# EasyEDA Pro project ProPrj_New Project_2026-05-24_21-45-30_2026-05-25.epro

# Schematic Schematic1
Board Name: Board1; Create Date: 2026-05-24; Page Name: P1; Project Name: New Project_2026-05-24_21-45-30; Schematic Name: Schematic1; Update Date: 2026-05-24; Company: EasyEDA.com; Page Size: A4; Version: V1.0
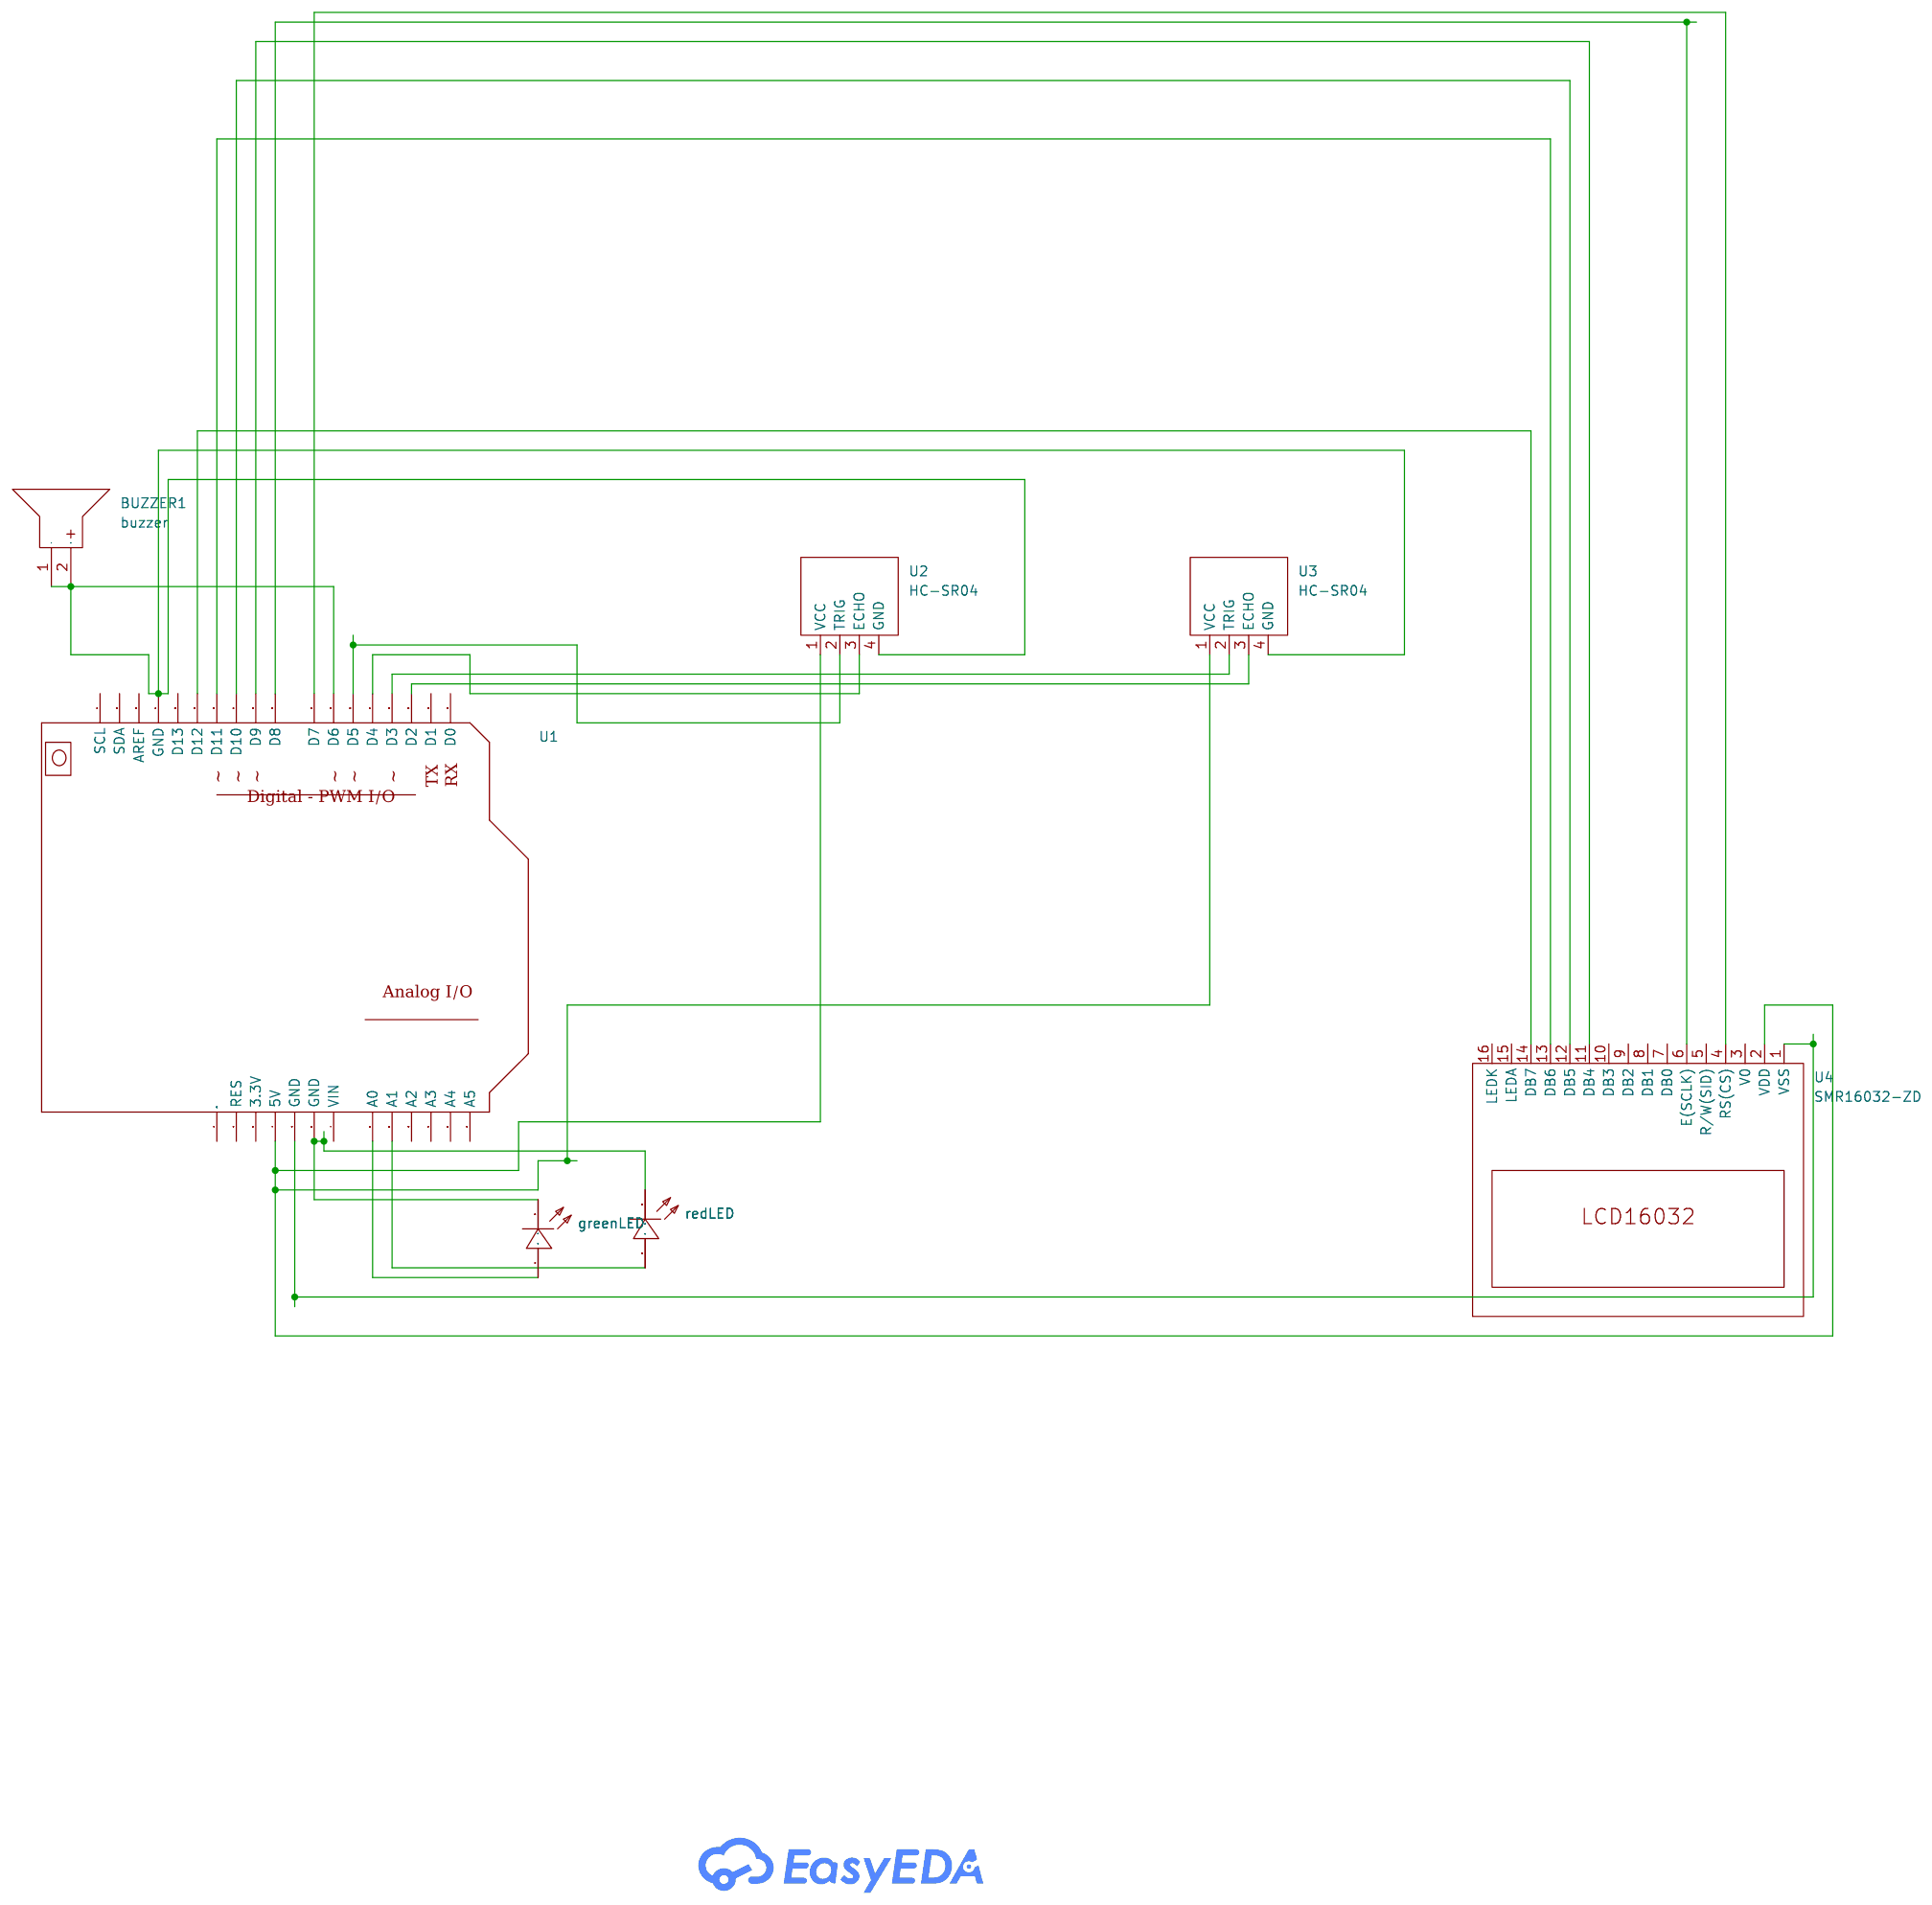
[diagram p0: schematic sheet]

## Parts
BUZZER1  buzzer  [BUZ-TH_BD12.0-P6.00-D0.9-RD]
greenLED  KT-0805G  [LED0805-R-RD]
redLED  KT-0805G  [LED0805-R-RD]
U1  -  [ARDUINO UNO R3 FOOTPRINT]
U2  HC-SR04  [TH_HC-SR04V]
U3  HC-SR04  [TH_HC-SR04V]
U4  SMR16032-ZD  [LCD-TH_SMR16032-ZD]

## Library data of the parts
BUZZER1 = buzzer: Supplier Part: C9900014030; JLCPCB Part Class: Extended Part; Supplier: LCSC
greenLED redLED = KT-0805G: Lamp Holder Type:2mm x 1.25mm square LED Illumination Color:Emerald Green Voltage - Forward(Vf):2.6V~3.1V Voltage - Forward(Vf):2.6V~3.1V Power(Watts):100mW Forward Current:5mA Wavelength - Dominant:513nm~528nm Wavelength - Dominant:513nm~528nm Peak Wavel; LCSC Part Name: 0805 翠绿 高亮; Supplier Part: C2297; Manufacturer: KENTO; Supplier Footprint: 0805; JLCPCB Part Class: Basic Part; Datasheet: https://item.szlcsc.com/datasheet/KT-0805G/2670.html; Supplier: LCSC; Lamp Holder Type: 2mm x 1.25mm square LED; Illumination Color: Emerald Green; Voltage - Forward(Vf): 2.6V~3.1V; Power(Watts): 100mW; Forward Current: 5mA; Wavelength - Dominant: 513nm~528nm; Peak Wavelength: 525nm; Diode Configuration: Discrete Diode; Lens Color: Water Clear; Luminous Intensity: 430mcd; Viewing Angle: 120°; Operating Temperature: -40℃~+85℃
U1 = Arduino Uno
U2 U3 = HC-SR04: Supplier Part: C19857336; Manufacturer: Universal Microelectronics; JLCPCB Part Class: Extended Part; Datasheet: https://item.szlcsc.com/datasheet/HC-SR04/21184790.html; Supplier: LCSC
U4 = SMR16032-ZD: Supplier Part: C9900249207; Supplier Footprint: LCD16032; Supplier: LCSC

## Nets
$1N2005: U1.26(D5) U2.2(TRIG)
$1N2008: U1.27(D4) U2.3(ECHO)
$1N2114: U1.29(D2) U3.3(ECHO)
$1N2119: U1.28(D3) U3.2(TRIG)
$1N2145: BUZZER1.1(-) BUZZER1.2(+) U1.17(GND) U1.25(D6) U2.4(GND) U3.4(GND)
$1N2179: U1.4(5V) U2.1(VCC) U3.1(VCC) U4.2(VDD)
$1N2219: U1.5(GND) U4.1(VSS)
$1N2269: U1.24(D7) U4.4(RS(CS))
$1N2279: U1.23(D8) U4.6(E(SCLK))
$1N2289: U1.22(D9) U4.11(DB4)
$1N2299: U1.21(D10) U4.12(DB5)
$1N2311: U1.20(D11) U4.13(DB6)
$1N2323: U1.19(D12) U4.14(DB7)
$1N2336: greenLED.1(A) U1.8(A0)
$1N2372: greenLED.2(K) redLED.2(K) U1.6(GND)
$1N2377: redLED.1(A) U1.9(A1)

Not connected (* = marked no-connect by the designer): U1 1(blnk) 2(RES) 3(3.3V) 7(VIN) 10(A2) 11(A3) 12(A4) 13(A5) 14(SCL) 15(SDA) 16(AREF) 18(D13) 30(D1) 31(D0); U4 3(V0) 5(R/W(SID)) 7(DB0) 8(DB1) 9(DB2) 10(DB3) 15(LEDA) 16(LEDK)

# Board PCB1
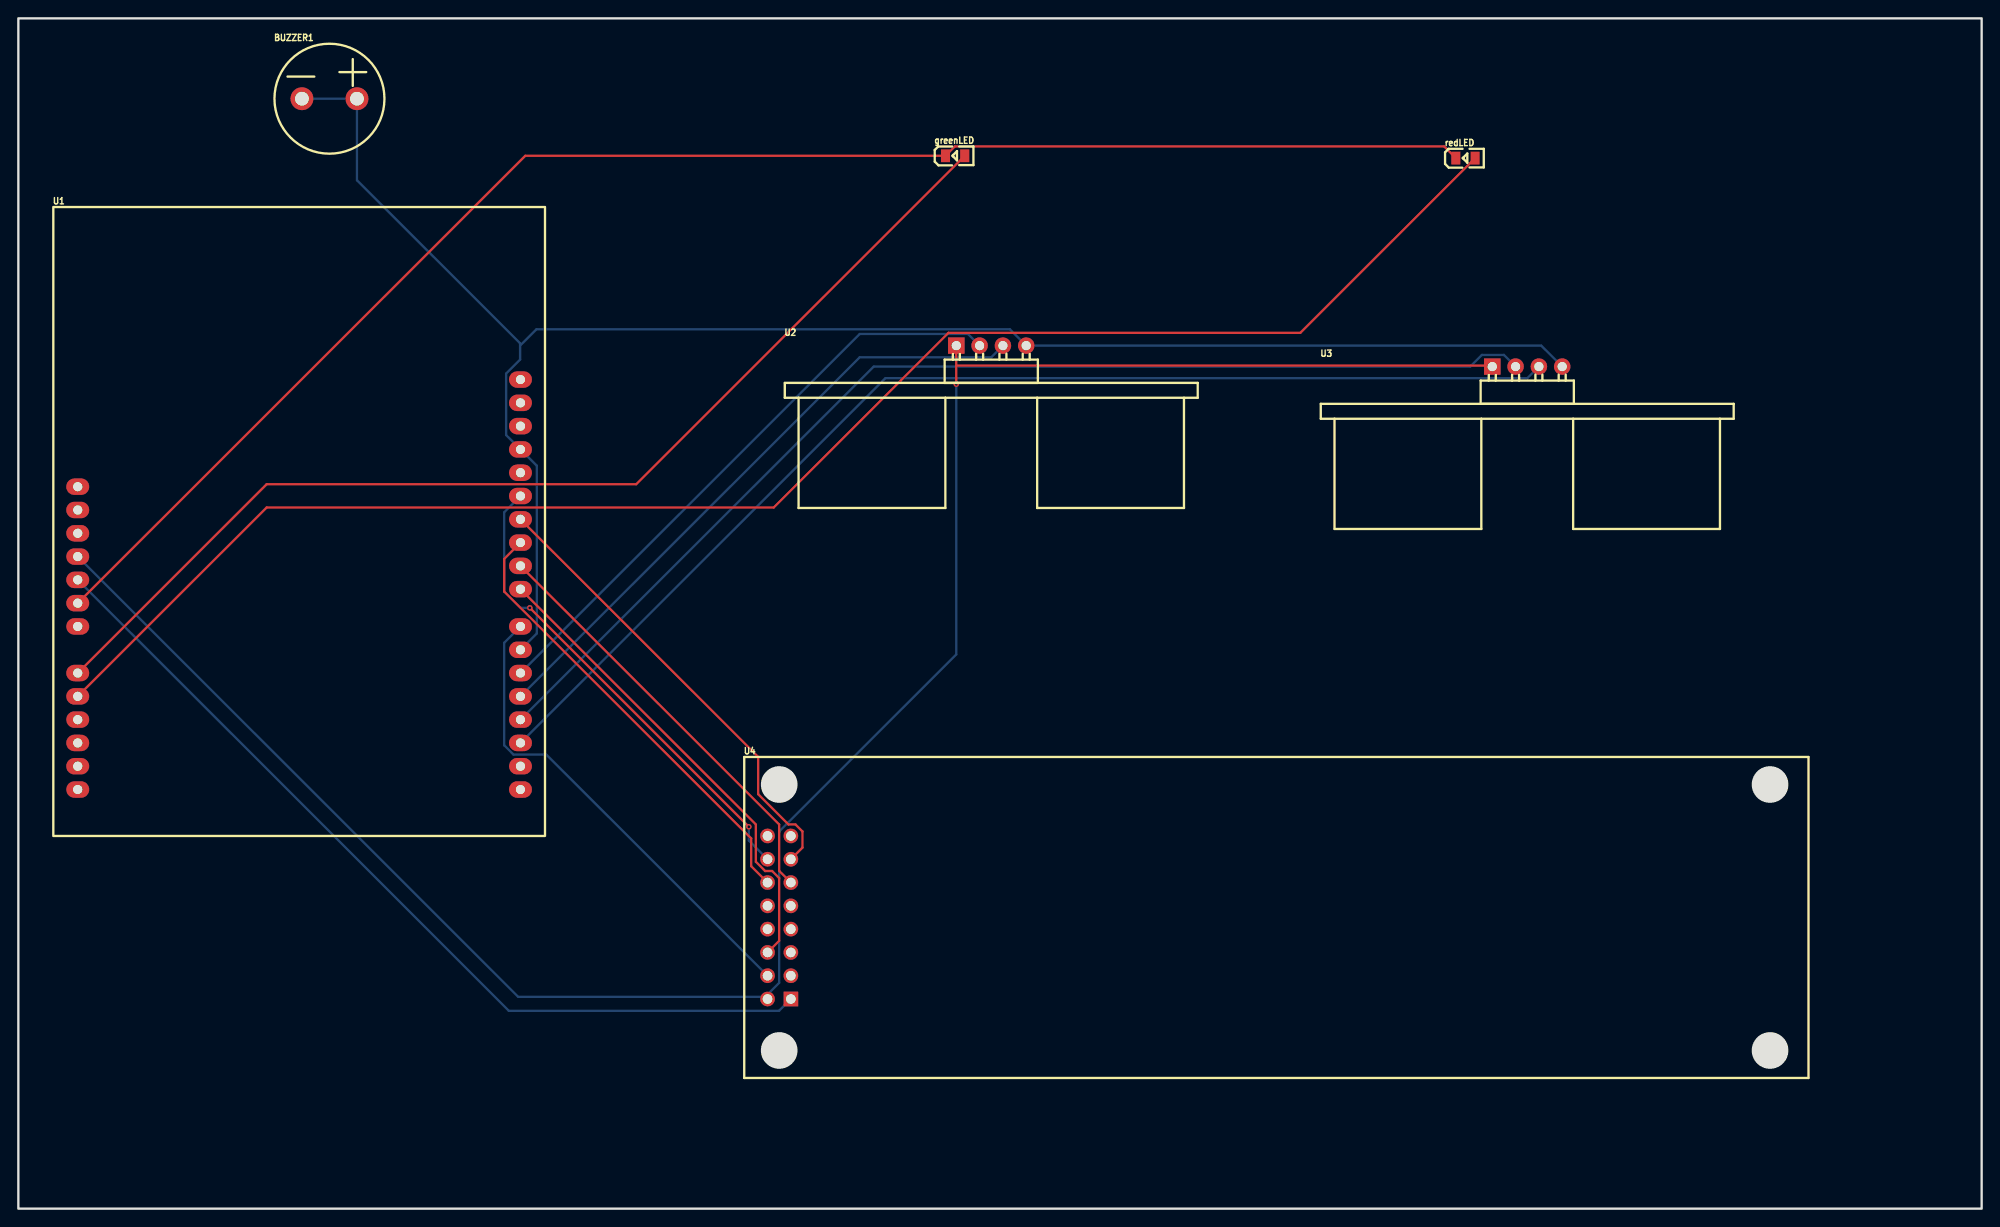
[diagram p1: board, top side]
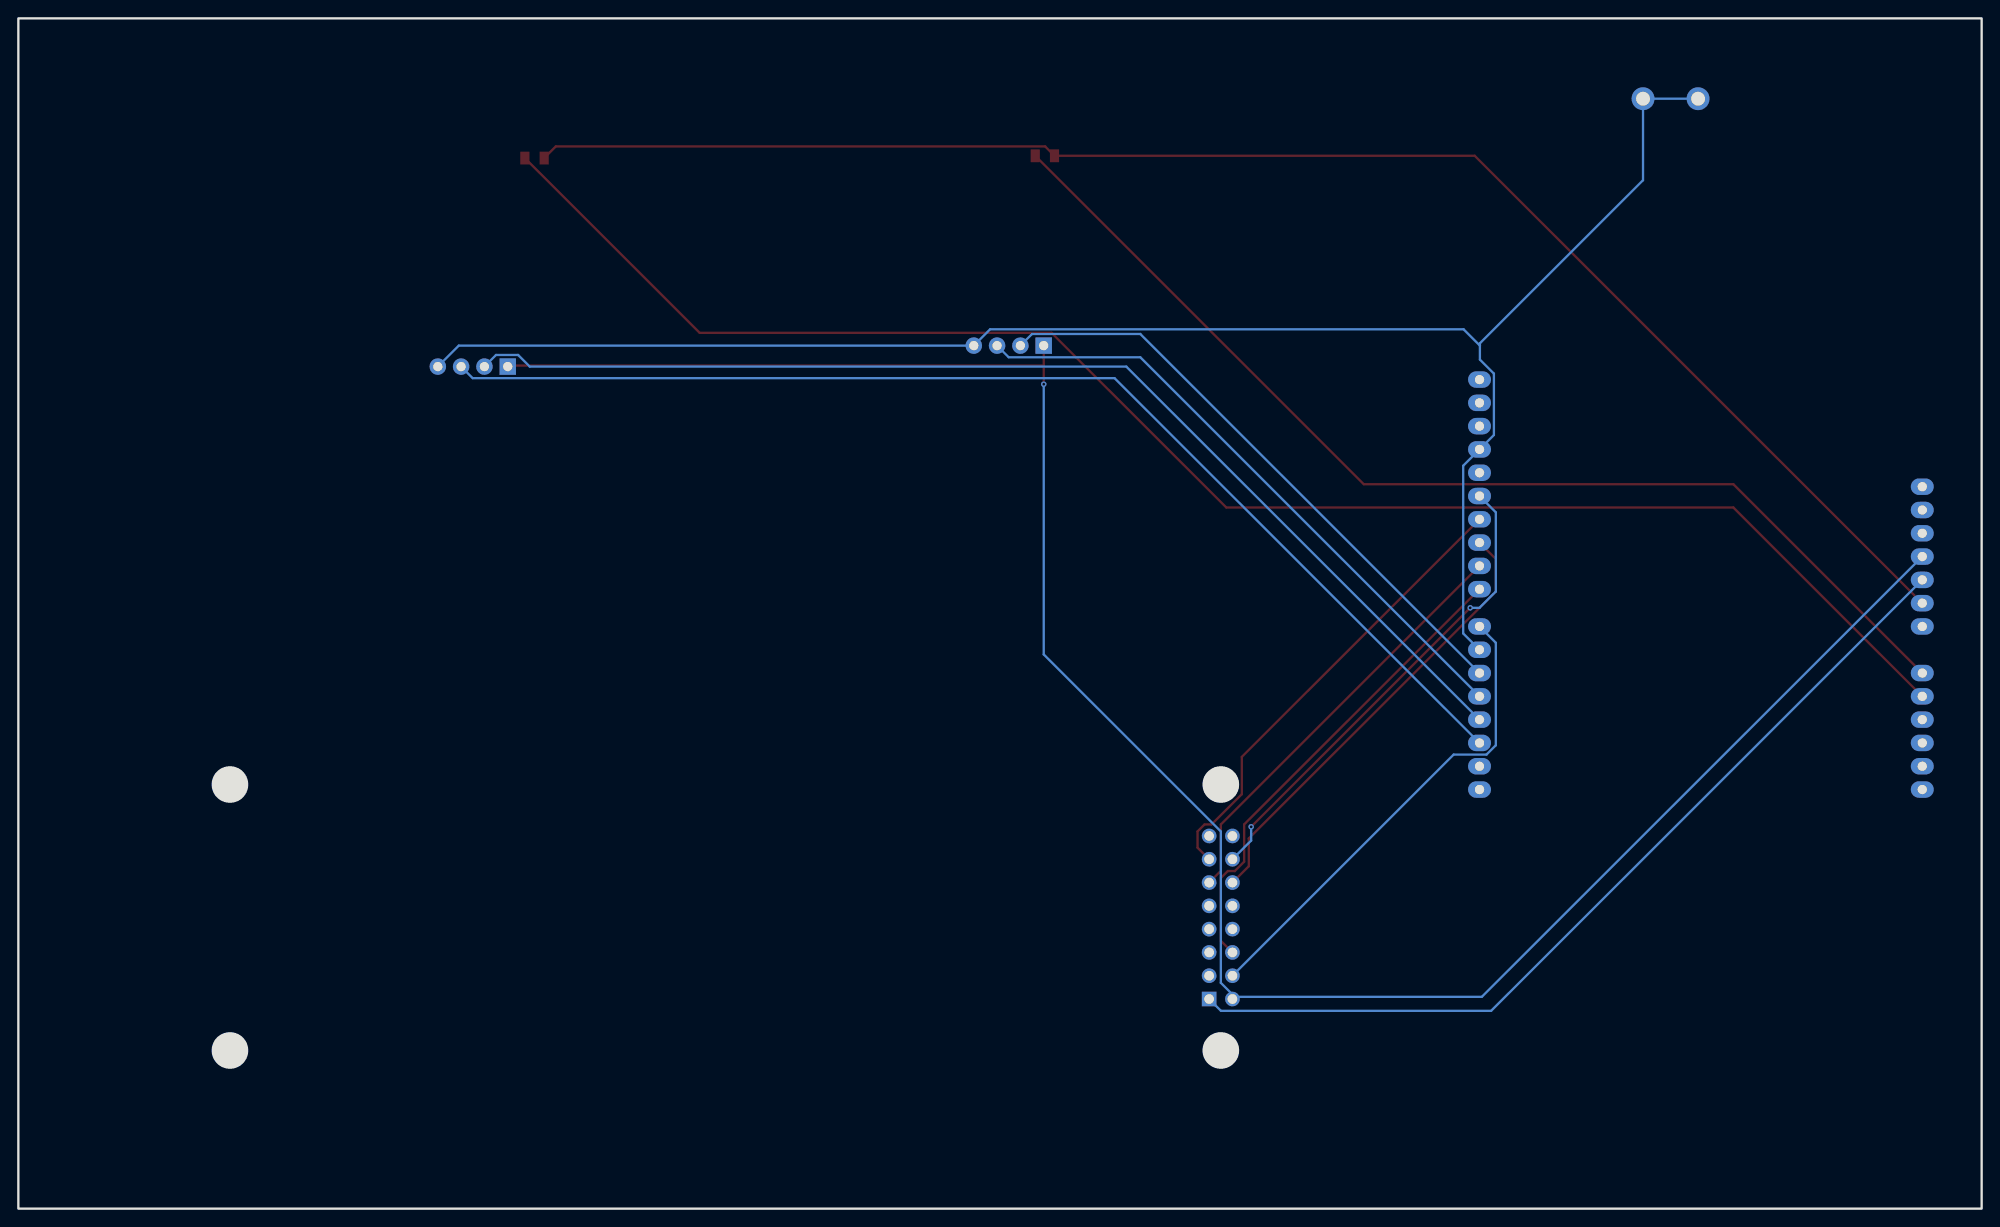
[diagram p2: board, bottom side, seen from below]

Outline 214 x 129.79 mm; copper layers: Top Layer, Bottom Layer. Coordinates in mm from the lower left corner of the outline.
Outline path: rectangle 0,129.79 214,0
Stack: Top Layer 0.035mm / Dielectric1 1.51mm FR4 er 4.5 / Bottom Layer 0.035mm

## Design rules (mm)
template: JLCPCB Capability(Two Layers Board)
spacing copperThickness1oz (default): track to track 0.102, other pairs 0.152 to 0.3
spacing copperThickness2oz: track to track 0.203, other pairs 0.152 to 0.3
track width copperThickness1oz (default): min 0.127, default 0.254, max 2.54
track width copperThickness2oz: min 0.203, default 0.254, max 2.54
differential pair differentialPair (default): width min 0.127, default 0.254, max 2.54; gap min 0.152, default 0.152
via viaSize (default): diameter min 0.5, default 0.61, max 10; hole min 0.3, default 0.305, max 6.3

## Placement (name value [footprint] x y rotation side)
BUZZER1  buzzer  [BUZ-TH_BD12.0-P6.00-D0.9-RD]  33.91 121.03 0 top
greenLED  KT-0805G  [LED0805-R-RD]  102.11 114.81 0 top
redLED  KT-0805G  [LED0805-R-RD]  157.73 114.55 0 top
U1  -  [ARDUINO UNO R3 FOOTPRINT]  3.94 40.64 0 top
U2  HC-SR04  [TH_HC-SR04V]  106.04 94.11 0 top
U3  HC-SR04  [TH_HC-SR04V]  164.47 91.82 0 top
U4  SMR16032-ZD  [LCD-TH_SMR16032-ZD]  82.93 31.75 0 top

## Footprints (pads in the part's own frame, mm; a bottom-side part is the same pattern mirrored in y, then rotated)
ARDUINO UNO R3 FOOTPRINT
  oval 2.5x1.8 hole 1.001: 1(2.535,38.085) 2(2.535,35.543) 3(2.535,33.004) 4(2.535,30.463) 5(2.535,27.924) 6(2.535,25.384) 7(2.535,22.843) 8(2.535,17.764) 9(2.535,15.223) 10(2.535,12.684) 11(2.535,10.143) 12(2.535,7.604) 13(2.535,5.064) 14(50.795,49.767) 15(50.795,47.227) 16(50.795,44.688) 17(50.795,42.148) 18(50.795,39.608) 19(50.795,37.068) 20(50.795,34.528) 21(50.795,31.988) 22(50.795,29.448) 23(50.795,26.907) 24(50.795,22.843) 25(50.795,20.303) 26(50.795,17.764) 27(50.795,15.223) 28(50.795,12.684) 29(50.795,10.143) 30(50.795,7.604) 31(50.795,5.064)
BUZ-TH_BD12.0-P6.00-D0.9-RD
  round 2.5 hole 1.5: 1(-3,0) 2(3,0)
LCD-TH_SMR16032-ZD
  rect 1.6x1.6 hole 1.05: 1(1.27,-8.89)
  round 1.6 hole 1.05: 2(-1.27,-8.89) 3(1.27,-6.35) 4(-1.27,-6.35) 5(1.27,-3.81) 6(-1.27,-3.81) 7(1.27,-1.27) 8(-1.27,-1.27) 9(1.27,1.27) 10(-1.27,1.27) 11(1.27,3.81) 12(-1.27,3.81) 13(1.27,6.35) 14(-1.27,6.35) 15(1.27,8.89) 16(-1.27,8.89)
LED0805-R-RD
  rect 1x1.399 smd: 1(1.05,0) 2(-1.05,0)
TH_HC-SR04V
  rect 1.8x1.8 hole 1.001: 1(-3.81,0)
  round 1.8 hole 1.001: 2(-1.27,0) 3(1.27,0) 4(3.81,0)

## Nets
As in the schematic.

Pads without a net: U1 1 2 3 7 10 11 12 13 14 15 16 18 30 31; U4 3 5 7 8 9 10 15 16

## Via types
v1: diameter 0.61, hole 0.305, Top Layer to Bottom Layer, 3 vias

## Routing (per net, layer and track width the routed paths; a pad name or vN(x,y) marks a point on that pad's centre or on a via; arc(x,y) is an arc through that point)
$1N2005: length 65.9
  Bottom Layer w0.254: U2.2 103.5,95.38 91.71,95.38 U1.26
$1N2008: length 68.4
  Bottom Layer w0.254: U2.3 106.04,92.84 91.71,92.84 U1.27
$1N2114: length 128
  Bottom Layer w0.254: U3.3 164.47,90.56 94.51,90.56 U1.29
$1N2119: length 125.5
  Bottom Layer w0.254: U1.28 93.23,91.82 158.25,91.82 159.52,93.09 161.92,93.09 U3.2
$1N2145: length 192.2
  Bottom Layer w0.254: U3.4 165.99,94.11 U2.4 108.08,95.88 56.47,95.88 54.69,94.11 ; U1.25 56.51,62.72 56.51,81.01 U1.17 53.16,84.35 53.16,91.06 54.69,92.58 54.69,94.11 ; 54.69,94.11 54.69,94.36 36.91,112.14 BUZZER1.2 BUZZER1.1
$1N2179: length 233.3
  Top Layer w0.254: 102.23,91.93 160.54,91.93 U3.1 ; 102.23,91.93 102.23,94.1 ; 102.23,91.93 v1(102.23,89.9)
  Bottom Layer w0.254: v1(102.23,89.9) 102.23,60.44 82.93,41.13 82.93,24.62 81.4,23.1 ; 81.4,23.1 54.48,23.1 U1.4 ; 81.4,23.1 81.66,22.86
$1N2219: length 97.7
  Bottom Layer w0.254: 84.2,22.86 82.91,21.57 53.46,21.57 U1.5
$1N2269: length 52.8
  Bottom Layer w0.254: U4.4 57.55,49.51 53.97,49.51 52.95,50.53 52.95,61.71 U1.24
$1N2279: length 52.3
  Top Layer w0.254: U4.6 82.93,29.2 82.93,36.05 82.16,36.81 81.4,36.81 80.39,37.83 80.39,41.89 U1.23
$1N2289: length 46.7
  Top Layer w0.254: U1.22 82.93,41.89 82.93,36.84 U4.11
$1N2299: length 49.7
  Top Layer w0.254: U4.12 79.88,37.34 79.88,40.37 52.95,67.29 52.95,70.85 U1.21
$1N2311: length 50.8
  Top Layer w0.254: U4.13 85.47,39.36 85.47,41.13 84.7,41.89 83.94,41.89 80.64,45.2 80.64,49.26 U1.20
$1N2323: length 52.8
  Top Layer w0.254: v1(55.75,65.52) v1(79.62,41.64)
  Bottom Layer w0.254: U1.19 52.95,75.93 52.95,67.29 54.73,65.52 v1(55.75,65.52) ; U4.14 79.62,40.14 v1(79.62,41.64)
$1N2336: length 120.1
  Top Layer w0.254: greenLED.1 67.34,78.99 27.06,78.99 U1.8
$1N2372: length 171.4
  Top Layer w0.254: redLED.2 155.41,115.82 102.07,115.82 greenLED.2 55.26,114.81 U1.6
$1N2377: length 176.6
  Top Layer w0.254: U1.9 27.06,76.45 82.33,76.45 101.38,95.5 139.73,95.5 redLED.1
